# EAGLE design pwmCatMoto (EAGLE 8.6.0)
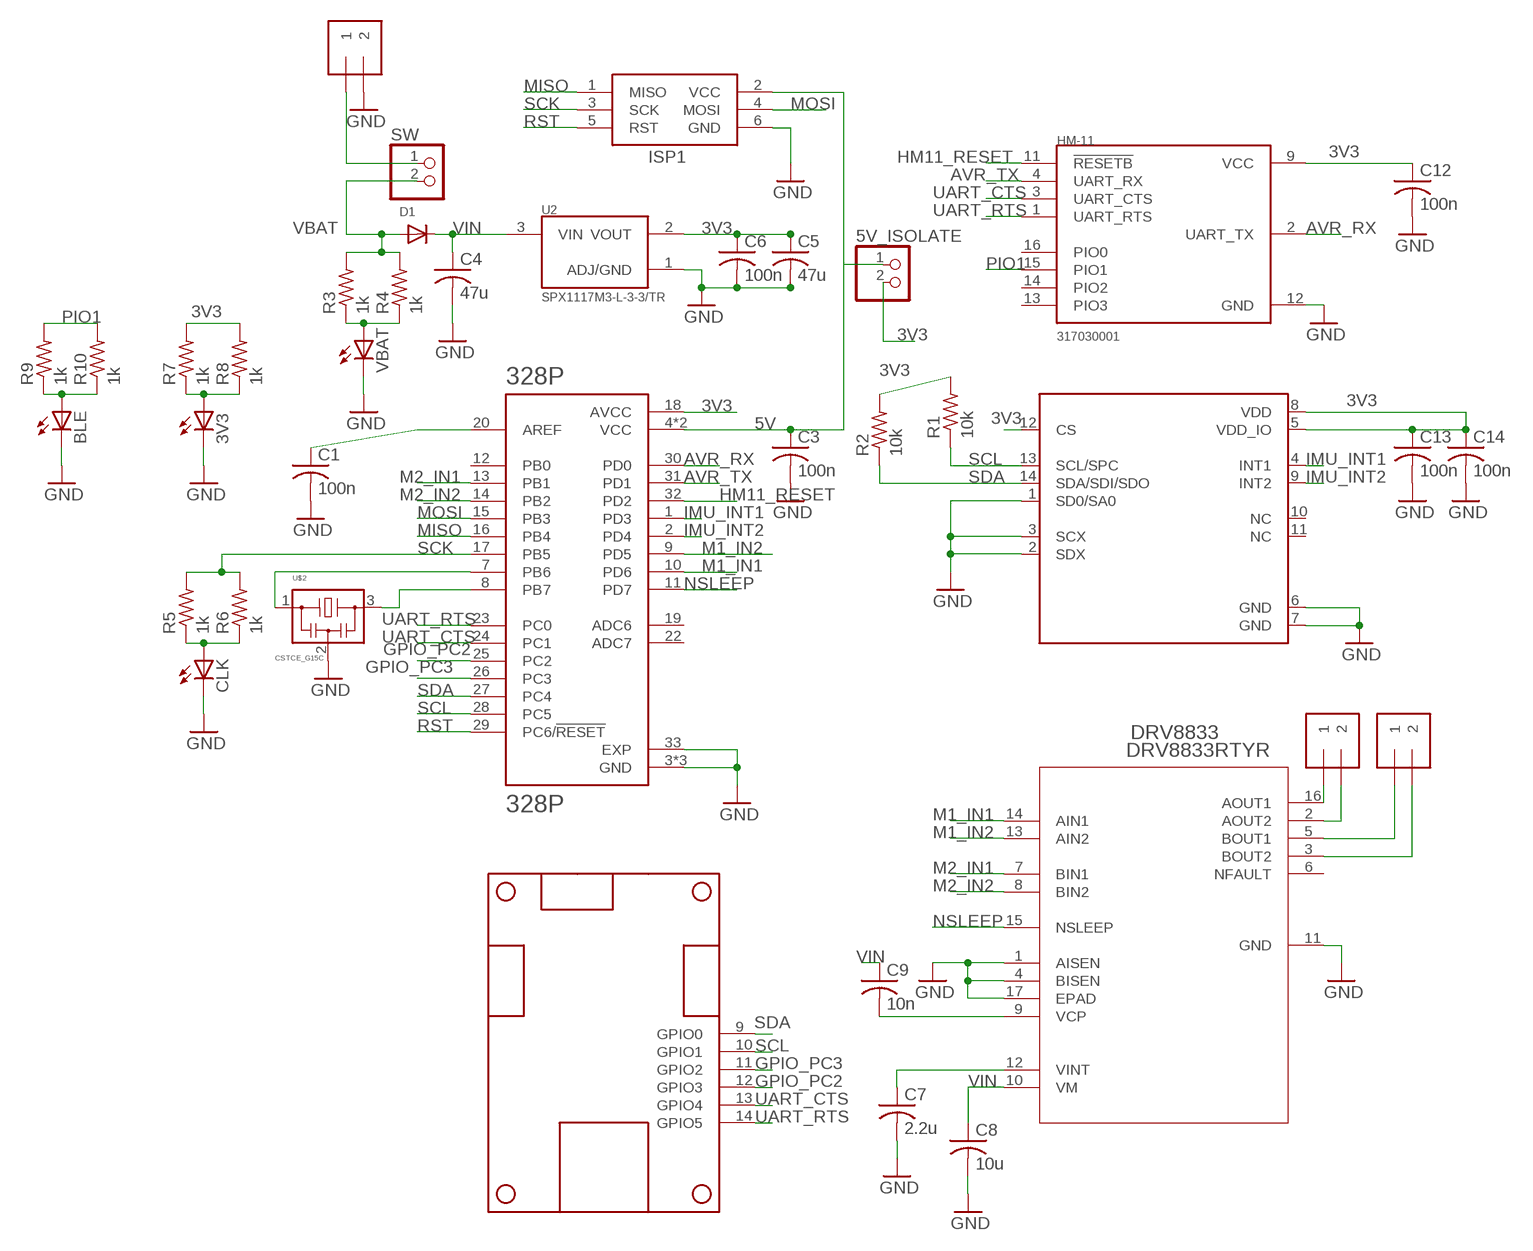
[diagram p0: schematic, sheet 1]

## Parts
3V3  LEDCHIPLED_0805  [CHIPLED_0805]
5V_ISOLATE  JUMPER  [1X02]
328P  328P  ATMEGA328P-MU  [QFN50P500X500X100-33N]
ACCEL  LSM6DS3TR  [14VFLGA_LSM6DS3TR]
BLE  LEDCHIPLED_0805  [CHIPLED_0805]
C1  100n  C-USC0402K  [C0402K]
C3  100n  C-USC0402K  [C0402K]
C4  47u  C-USC0805K  [C0805K]
C5  47u  C-USC0805K  [C0805K]
C6  100n  C-USC0402K  [C0402K]
C7  2.2u  C-USC0402K  [C0402K]
C8  10u  C-USC0402K  [C0402K]
C9  10n  C-USC0402K  [C0402K]
C12  100n  C-USC0402K  [C0402K]
C13  100n  C-USC0402K  [C0402K]
C14  100n  C-USC0402K  [C0402K]
CLK  LEDCHIPLED_0805  [CHIPLED_0805]
D1  DIODESOD-123  [SOD-123]
DRV8833  DRV8833RTYR  [RTY16]
HM-11  317030001  [XCVR_317030001]
ISP1  AVRISP-6  [AVRISP]
J4  1X2-3.5MM  [1X2-3.5MM]
J5  1X2-3.5MM  [1X2-3.5MM]
J6  1X2-3.5MM  [1X2-3.5MM]
R1  10k  R-US_R0402  [R0402]
R2  10k  R-US_R0402  [R0402]
R3  1k  R-US_R0402  [R0402]
R4  1k  R-US_R0402  [R0402]
R5  1k  R-US_R0402  [R0402]
R6  1k  R-US_R0402  [R0402]
R7  1k  R-US_R0402  [R0402]
R8  1k  R-US_R0402  [R0402]
R9  1k  R-US_R0402  [R0402]
R10  1k  R-US_R0402  [R0402]
SW  KILLSWITCH  [1X02]
U2  SPX1117M3-L-3-3/TR  [SOT230P700X180-3N]
U$1  TANK_BOARD_OUTLINE_GPIO  [TANK_BOARD_1]
U$2  CSTCE_G15C  [CSTCE_G15C]
VBAT  LEDCHIPLED_0805  [CHIPLED_0805]

## Nets
3V3: 5V_ISOLATE.2 328P.18(AVCC) ACCEL.5(VDD_IO) ACCEL.8(VDD) ACCEL.12(CS) C5.1 C6.1 C12.1 C13.1 C14.1 HM-11.9(VCC) R1.2 R2.2 R7.2 R8.2 U2.2(VOUT)
5V: 5V_ISOLATE.1 328P.4(VCC) 328P.6(VCC) C3.1 ISP1.2(VCC)
AVR_RX: 328P.30(PD0) HM-11.2(UART_TX)
AVR_TX: 328P.31(PD1) HM-11.4(UART_RX)
GND: 3V3.C 328P.3(GND) 328P.5(GND) 328P.21(GND) 328P.33(EXP) ACCEL.1(SD0/SA0) ACCEL.2(SDX) ACCEL.3(SCX) ACCEL.6(GND) ACCEL.7(GND) BLE.C C1.2 C3.2 C4.2 C5.2 C6.2 C7.2 C8.2 C12.2 C13.2 C14.2 CLK.C DRV8833.1(AISEN) DRV8833.4(BISEN) DRV8833.11(GND) DRV8833.17(EPAD) HM-11.12(GND) ISP1.6(GND) J4.2 U2.1(ADJ/GND) U$2.2 VBAT.C
GPIO_PC2: 328P.25(PC2) U$1.12(GPIO3)
GPIO_PC3: 328P.26(PC3) U$1.11(GPIO2)
HM11_RESET: 328P.32(PD2) HM-11.11(!RESETB)
IMU_INT1: 328P.1(PD3) ACCEL.4(INT1)
IMU_INT2: 328P.2(PD4) ACCEL.9(INT2)
M1_IN1: 328P.10(PD6) DRV8833.14(AIN1)
M1_IN2: 328P.9(PD5) DRV8833.13(AIN2)
M2_IN1: 328P.13(PB1) DRV8833.7(BIN1)
M2_IN2: 328P.14(PB2) DRV8833.8(BIN2)
MISO: 328P.16(PB4) ISP1.1(MISO)
MOSI: 328P.15(PB3) ISP1.4(MOSI)
N$1: C7.1 DRV8833.12(VINT)
N$2: 328P.7(PB6) U$2.1
N$3: 328P.8(PB7) U$2.3
N$4: 328P.20(AREF) C1.1
N$5: C9.2 DRV8833.9(VCP)
N$6: J4.1 SW.1
N$7: R3.1 R4.1 VBAT.A
N$9: BLE.A R9.1 R10.1
N$11: CLK.A R5.1 R6.1
N$13: 3V3.A R7.1 R8.1
N$17: DRV8833.16(AOUT1) J5.1
N$18: DRV8833.2(AOUT2) J5.2
N$19: DRV8833.5(BOUT1) J6.1
N$20: DRV8833.3(BOUT2) J6.2
NSLEEP: 328P.11(PD7) DRV8833.15(NSLEEP)
PIO1: HM-11.15(PIO1) R9.2 R10.2
RST: 328P.29(PC6/!RESET) ISP1.5(RST)
SCK: 328P.17(PB5) ISP1.3(SCK) R5.2 R6.2
SCL: 328P.28(PC5) ACCEL.13(SCL/SPC) R1.1 U$1.10(GPIO1)
SDA: 328P.27(PC4) ACCEL.14(SDA/SDI/SDO) R2.1 U$1.9(GPIO0)
UART_CTS: 328P.24(PC1) HM-11.3(UART_CTS) U$1.13(GPIO4)
UART_RTS: 328P.23(PC0) HM-11.1(UART_RTS) U$1.14(GPIO5)
VBAT: D1.A R3.2 R4.2 SW.2
VIN: C4.1 C8.1 C9.1 D1.C DRV8833.10(VM) U2.3(VIN)
Unconnected: 328P.12(PB0) 328P.19(ADC6) 328P.22(ADC7) DRV8833.6(NFAULT) HM-11.13(PIO3) HM-11.14(PIO2) HM-11.16(PIO0)

## Power pins joined to a net without a drawn wire
NC: ACCEL.10(NC) ACCEL.11(NC)

## Library data of the parts
3V3 BLE CLK VBAT = adafruit:LED: LED OSRAM: - CHIPLED LG R971, LG N971, LY N971, LG Q971, LY Q971, LO R971, LY R971 LH N974, LH R974 LS Q976, LO Q976, LY Q976 LO Q996 - Hyper CHIPLED LW Q18S LB Q993, LB Q99A, LB R99A - SideLED LS A670, LO A670, LY A670, LG A670, LP A670 LB A673, LV A673, LT A673, LW A673 LH A674 LY A675 LS A676, LA A676, LO A676, LY A676, LW A676 LS A679, LY A679, LG A679 - Hyper Micro SIDELED® LS Y876, LA Y876, LO Y876, LY Y876 LT Y87S - SmartLED LW L88C, LW L88S LB L89C, LB L89S, LG L890 LS L89K, LO L89K, LY L89K LS L896, LA L896, LO L896, LY L896 - TOPLED LS T670, LO T670, LY T670, LG T670, LP T670 LSG T670, LSP T670, LSY T670, LOP T670, LYG T670 LG T671, LOG T671, LSG T671 LB T673, LV T673, LT T673, LW T673 LH T674 LS T676, LA T676, LO T676, LY T676, LB T676, LH T676, LSB T676, LW T676 LB T67C, LV T67C, LT T67C, LS T67K, LO T67K, LY T67K, LW E67C LS E67B, LA E67B, LO E67B, LY E67B, LB E67C, LV E67C, LT E67C LW T67C LS T679, LY T679, LG T679 LS T770, LO T770, LY T770, LG T770, LP T770 LB T773, LV T773, LT T773, LW T773 LH T774 LS E675, LA E675, LY E675, LS T675 LS T776, LA T776, LO T776, LY T776, LB T776 LHGB T686 LT T68C, LB T68C - Hyper Mini TOPLED® LB M676 - Mini TOPLED Santana® LG M470 LS M47K, LO M47K, LY M47K Source: http://www.osram.convergy.de/
5V_ISOLATE = EE310_rcTank_ProtoA:JUMPER
328P = EE310_rcTank_ProtoA:ATMEGA328P-MU: ATmega Series 20 MHz 32 KB Flash 2 KB SRAM 8-Bit Microcontroller - QFN-32; AVAILABILITY: Good; DESCRIPTION: IC MCU 8BIT 32KB FLASH 32VQFN; MF: Microchip; MP: ATMEGA328P-MU; PACKAGE: VQFN-32 Microchip; PRICE: 2.07 USD
ACCEL = EE310_rcTank_ProtoA:LSM6DS3TR
C1 C3-C9 C12-C14 = rcl:C-US: CAPACITOR, American symbol; SPICEPREFIX: C
D1 = adafruit:DIODE: Diode SMADIODE - SMA Surface Mount Package 20V 1A Schottky Diode Digikey: 641-1014-6-ND DO-1N4148 - Through Hole Small Current Diode SOD-123 20V 1 A (.5mV Vf) Schottky Diode - Digikey: MBRX120TPMSCT-ND SOD-323 10V 570mA (.38mV Vf, 3ns) Schottky Diode - Digikey: ZLLS410CT-ND SOD-523 30V 30mA Schottky Diode (RB751S-40TE61) - Digikey: RB751S-40TE61CT-ND SOT23-R/W - SOT23 Package (R = Solder Paste/Reflow Ovens, W = Hand-Soldering) BAT54Film 40V 300mA - Digikey: 497-7162-1-ND
DRV8833 = EE310_rcTank_ProtoA:DRV8833RTYR; MANUFACTURER_PART_NUMBER: DRV8833RTYR; VENDOR: Texas Instruments
HM-11 = EE310_rcTank_ProtoA:317030001: Bluetooth V4.0 Hm-11 Ble Module; AVAILABILITY: Bad; DESCRIPTION: BLUETOOTH V4.0 HM-11 BLE MODULE; MF: Seeed Studio; MP: 317030001; PACKAGE: Module Seeed Studio; PRICE: 12.89 USD
ISP1 = adafruit:AVRISP: AVR ISP HEADER Standard 6 pin header for AVR programming
J4-J6 = adafruit:1X2: 3.5mm Terminal block http://www.ladyada.net/library/pcb/eaglelibrary.html
R1-R10 = rcl:R-US_: RESISTOR, American symbol; SPICEPREFIX: R
SW = EE310_rcTank_ProtoA:KILLSWITCH
U2 = EE310_rcTank_ProtoA:SPX1117M3-L-3-3/TR; AVAILABILITY: Good; DESCRIPTION: IC REG LINEAR 3.3V 800MA SOT223; MF: Exar Corporation; MP: SPX1117M3-L-3-3/TR; PACKAGE: SOT-223 Exar; PRICE: 0.19 USD
U$1 = EE310_rcTank_ProtoA:TANK_BOARD_OUTLINE_GPIO
U$2 = EE310_rcTank_ProtoA:CSTCE_G15C

## Board
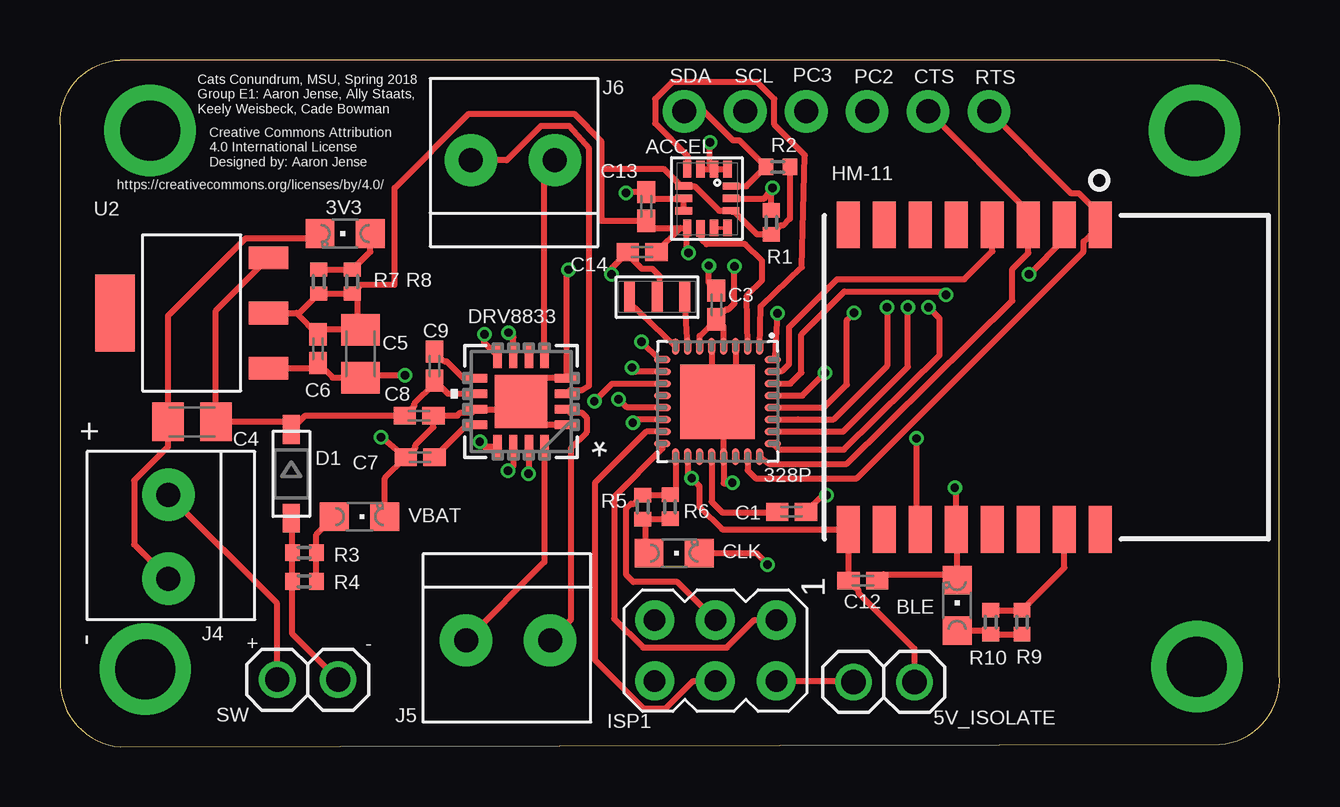
[diagram p1: board, top side]
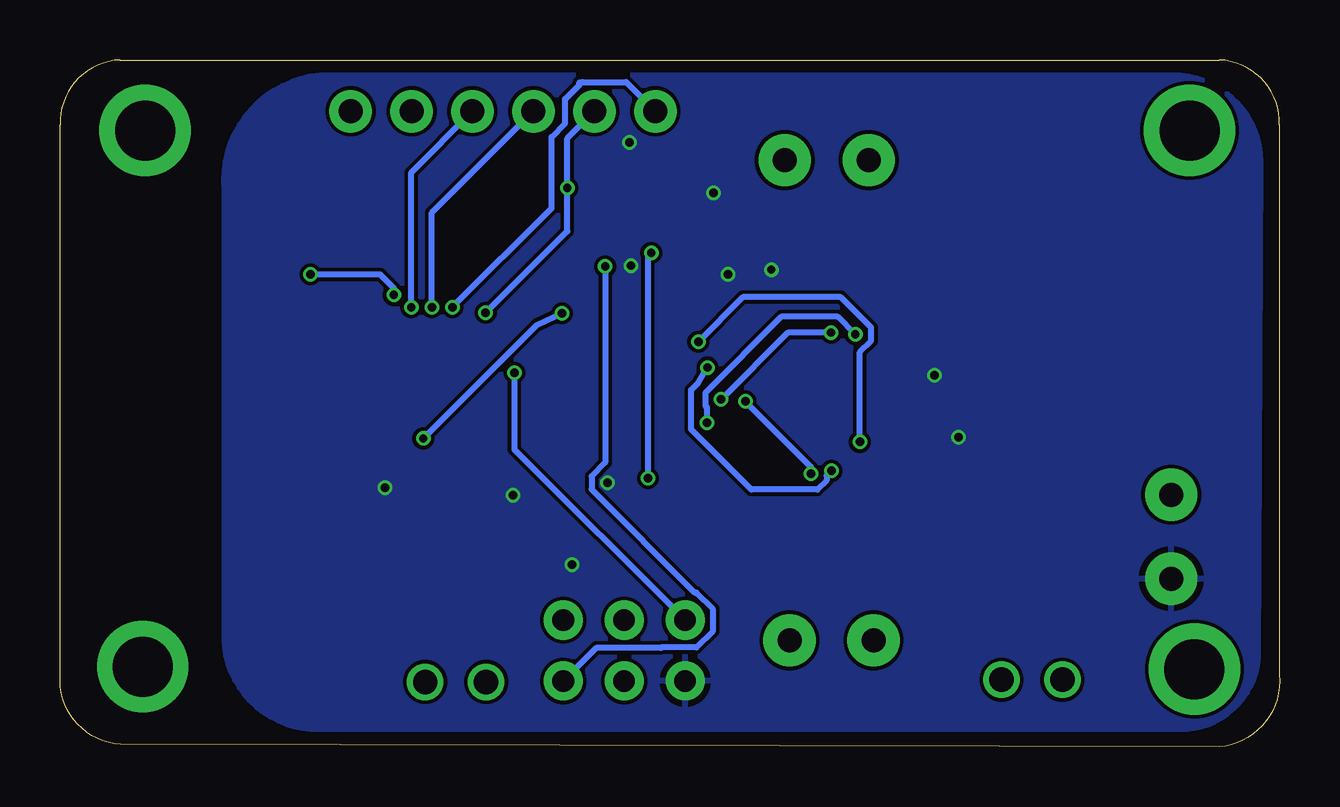
[diagram p2: board, bottom side, seen from below]

Size 50.82 x 28.64 mm. Coordinates in mm from the lower left corner, seen from the top.
Copper layers (1*16): Top 0.035559375mm / dielectric 1.6mm / Bottom 0.035559375mm
Design rules "oshpark-2layer": minimum track width 6mil, minimum drill 10mil, track to track 6mil, track to pad 6mil, pad to pad 6mil, via to via 6mil, smd to smd 6mil, copper to edge 15mil, drill to drill 6mil, minimum pad ring 5mil, minimum via ring 5mil, stop-mask expansion 2.5mil, vias tented up to drill 0mil, thermal gap 10mil

### Footprints (pad centres in the part's own frame; a part is rotated, then mirrored left to right if it is on the bottom)
CHIPLED_0805 = smd 1.2 x 1.2: A 0,-1.05; C 0,1.05
1X02 = drill 1.016: 1 1.27,0; 2 3.81,0
QFN50P500X500X100-33N = smd 0.69 x 0.29: 1 -2.3,1.75; 8 -2.3,-1.75; 17 2.3,-1.75; 24 2.3,1.75 | smd 0.7 x 0.29: 2 -2.3,1.25; 3 -2.3,0.75; 4 -2.3,0.25; 5 -2.3,-0.25; 6 -2.3,-0.75; 7 -2.3,-1.25; 18 2.3,-1.25; 19 2.3,-0.75; 20 2.3,-0.25; 21 2.3,0.25; 22 2.3,0.75; 23 2.3,1.25 | smd 0.29 x 0.69: 9 -1.75,-2.3; 16 1.75,-2.3; 25 1.75,2.3; 32 -1.75,2.3 | smd 0.29 x 0.7: 10 -1.25,-2.3; 11 -0.75,-2.3; 12 -0.25,-2.3; 13 0.25,-2.3; 14 0.75,-2.3; 15 1.25,-2.3; 26 1.25,2.3; 27 0.75,2.3; 28 0.25,2.3; 29 -0.25,2.3; 30 -0.75,2.3; 31 -1.25,2.3 | smd 3.1 x 3.1: 33 0,0
14VFLGA_LSM6DS3TR = smd 0.69 x 0.34: 1 -1.22,0.84; 2 -1.22,0.28; 3 -1.22,-0.28; 4 -1.22,-0.84; 8 1.23,-0.84; 9 1.24,-0.28; 10 1.23,0.28; 11 1.23,0.84 | smd 0.3 x 0.69: 5 -0.52,-0.98; 6 0,-0.98; 7 0.52,-0.98; 12 0.51,0.99; 13 0,0.99; 14 -0.51,0.99
C0402K = smd 0.925 x 0.74: 1 -0.6,0; 2 0.6,0
C0805K = smd 1.3 x 1.6: 1 -1,0; 2 1,0
SOD-123 = smd 1.2 x 0.7: A 1.85,0; C -1.85,0
RTY16 = smd 1 x 0.35: 1 -1.9,0.975; 2 -1.9,0.325; 3 -1.9,-0.325; 4 -1.9,-0.975; 9 1.9,-0.975; 10 1.9,-0.325; 11 1.9,0.325; 12 1.9,0.975 | smd 0.35 x 1: 5 -0.975,-1.9; 6 -0.325,-1.9; 7 0.325,-1.9; 8 0.975,-1.9; 13 0.975,1.9; 14 0.325,1.9; 15 -0.325,1.9; 16 -0.975,1.9 | smd 2.2 x 2.2: 17 0,0
XCVR_317030001 = smd 1.95 x 0.95: 1 -6.35,2.25; 2 -6.35,0.75; 3 -6.35,-0.75; 4 -6.35,-2.25; 5 -6.35,-3.75; 6 -6.35,-5.25; 7 -6.35,-6.75; 8 -6.35,-8.25; 9 6.35,-8.25; 10 6.35,-6.75; 11 6.35,-5.25; 12 6.35,-3.75; 13 6.35,-2.25; 14 6.35,-0.75; 15 6.35,0.75; 16 6.35,2.25
AVRISP = drill 0.9 pad 1.626: 1 -1.27,2.54; 2 1.27,2.54; 3 -1.27,0; 4 1.27,0; 5 -1.27,-2.54; 6 1.27,-2.54
1X2-3.5MM = drill 1 pad 2.184: 1 1.8,0; 2 -1.7,0
R0402 = smd 0.6 x 0.7: 1 -0.5,0; 2 0.5,0
SOT230P700X180-3N = smd 1.65 x 0.95: 1 -3.2,2.3; 2 -3.2,0; 3 -3.2,-2.3 | smd 1.65 x 3.2: 4 3.2,0
TANK_BOARD_1 = drill 1 pad 1.778: 9 24.73,26; 10 27.27,26; 11 29.81,26; 12 32.35,26; 13 34.89,26; 14 37.43,26 | drill 2.5 pad 3.81: P$5 2.47,25.2; P$6 2.27,2.74; P$7 45.99,25.2; P$8 46.09,2.84
CSTCE_G15C = smd 0.45 x 1.3: 1 0.45,-0.65; 2 1.6,-0.65; 3 2.75,-0.65

### Placement (x,y rotation side)
3V3  11.88,21.4 90 top
5V_ISOLATE  31.79,2.71 0 top
328P  27.4,14.4 270 top
ACCEL  26.97,22.87 270 top
BLE  37.38,5.9 0 top
C1  30.48,9.8 0 top
C3  27.35,18.43 90 top
C4  5.5,13.55 180 top
C5  12.52,16.39 270 top
C6  10.75,16.6 270 top
C7  15,12.08 180 top
C8  14.96,13.81 0 top
C9  15.61,15.88 90 top
C12  33.45,6.94 0 top
C13  24.43,22.53 90 top
C14  24.25,20.63 180 top
CLK  25.59,8.08 270 top
D1  9.64,11.38 270 top
DRV8833  19.21,14.4 180 top
HM-11  41.1,15.42 270 top
ISP1  27.31,4.02 270 top
J4  4.52,8.71 90 top
J5  18.72,4.44 180 top
J6  18.82,24.46 0 top
R1  29.64,21.87 270 top
R2  29.91,24.18 0 top
R3  10.18,8.1 180 top
R4  10.18,6.9 180 top
R5  24.28,10 90 top
R6  25.42,10.01 90 top
R7  10.78,19.4 270 top
R8  12.18,19.4 270 top
R9  40.08,5.2 90 top
R10  38.78,5.2 90 top
SW  7.78,2.8 0 top
U2  5.49,18.09 180 top
U$1  1.28,0.5 0 top
U$2  26.48,18.1 180 top
VBAT  12.48,9.6 270 top

### Tracks (layer width: path | path; a pad name or v marks a point on that pad's centre or on a via)
3V3  (via drill 0.35)
  Top 0.254: 25.86,21.64 24.72,21.64 C13.1 22.55,21.93 22.55,24.1 | 29.52,21.37 R1.2 | R1.2 29.04,21.37 28.1,22.31 28,22.31 ACCEL.12 27.46,22.36 26.44,23.38 26,23.38 ACCEL.5 25.96,23.41 25.84,23.41 25.16,24.1 22.55,24.1 | R1.2 30.01,21.74 30.13,21.74 30.41,22.02 R2.2 | C5.1 12.38,17.39 | 12.38,17.39 10.94,17.39 C6.1 9.86,18.09 U2.2 9.97,18.09 R7.2 R8.2 | R8.2 12.38,18.7 12.38,17.39 | R8.2 12.55,19.27 13.95,19.27 13.95,23.3 17.04,26.39 21.42,26.39 22.55,25.26 22.55,24.1 | 25.86,21.64 C14.1 24.88,20.6 | 25.86,21.64 ACCEL.8 | ACCEL.8 | 5V_ISOLATE.2 35.6,4.09 33.26,6.43 33.26,6.53 C12.1 HM-11.9 27.59,9.07 26.64,10.01 26.64,10.88 v26.32,11.2 26.16,11.36 328P.18 | v26.18,20.6 26.12,20.66 ACCEL.8
  Bottom 0.254: v26.18,20.6 26.32,20.46 v26.32,11.2
5V  (via drill 0.35)
  Top 0.254: 328P.4 27.65,17.53 C3.1 | 328P.6 26.65,17.13 C3.1 | C3.1 27.75,18.24 27.85,18.24 28.1,18.48 v28.1,20.03 | 5V_ISOLATE.1 33.03,2.75 ISP1.2
  Bottom 0.254: v28.1,20.03 28.1,11.85 28.67,11.28 28.67,10.74 24.36,6.43 24.3,6.43 23.63,5.76 23.63,4.81 24.3,4.14 25.76,4.14 25.78,4.12 28.48,4.12 ISP1.2
AVR_RX  (via drill 0.35)
  Top 0.254: v40.38,19.7 41.85,21.17 HM-11.2 | 328P.30 30.43,15.15 30.89,15.61 30.89,17.2 32.68,18.99 36.76,18.99 v36.91,18.84
  Bottom 0.254: v40.38,19.7 37.48,19.7 36.91,19.13 v36.91,18.84
AVR_TX
  Top 0.254: HM-11.4 38.85,20.67 37.68,19.5 32.38,19.5 30.38,17.5 30.38,15.96 30.1,15.67 29.73,15.67 328P.31
GND  (via drill 0.35)
  Top 0.254: DRV8833.1 20.16,13.42 19.21,14.37 DRV8833.17 18.89,14.07 DRV8833.11 17.17,13.93 16.68,13.93 16.55,13.81 C8.2 15.56,13.33 14.81,12.58 14.81,12.48 C7.2 | ACCEL.7 ACCEL.6 24.69,22.87 C13.2 23.61,23.13 v23.58,23.1 | BLE.C 37.38,7.2 | 37.38,7.2 37.38,9.04 HM-11.12 37.35,10.73 v37.28,10.8 | C12.2 34.32,7.2 37.38,7.2 | U2.1 10.54,15.79 C6.2 11.36,15.39 C5.2 12.63,15.5 v14.38,15.5 | J4.2 3.09,8.44 3.09,11.1 4.5,12.51 C4.2 4.5,17.97 7.72,21.19 10.62,21.19 3V3.C | VBAT.C 13.53,11.21 C7.2 | 328P.5 27.15,14.65 328P.33 | 328P.3 28.15,15.15 328P.33 | DRV8833.4 | DRV8833.4 21.11,19.83 v21.18,19.9 | ACCEL.3 ACCEL.2 | ACCEL.2 ACCEL.1 | ACCEL.2 27.08,24.26 v27.08,25.2 | U$2.2 24.99,19.45 24.99,19.64 24.7,19.93 24.25,19.93 23.71,20.47 23.65,20.47 C14.2 22.98,19.96 v22.98,19.7 | CLK.C 26.88,7.65 | 29.4,7.68 v29.48,7.6 29,8.08 CLK.C | 27.71,13.22 27.67,13.19 | 27.67,13.19 27.68,13.19 27.68,14.12 328P.33 | CLK.C 27.07,7.65 | v28.01,11.01 27.87,10.99 27.65,10.99 328P.21 27.65,13.19 27.67,13.19 | DRV8833.4 | DRV8833.4 20.19,15.38 | C7.2 v13.38,12.91 | C1.2 31.77,10.49 v31.94,10.49 | C3.2 27.03,19.35 v27.03,20.07
  pour Bottom: 0.78,24.4 arc-90 4.48,27.99 39.98,27.99 arc-90 43.98,23.2 43.98,4.5 arc-90 39.98,0.75 4.48,0.75 arc-90 0.88,3.7
GPIO_PC2  (via drill 0.35)
  Top 0.254: 328P.25 29.95,12.4 32.67,12.4 36.65,16.33 36.65,17.86 v36.18,18.33
  Bottom 0.254: v36.18,18.33 36.18,23.95 U$1.12
GPIO_PC3  (via drill 0.35)
  Top 0.254: 29.73,13.17 328P.26 32.63,13.15 35.32,15.84 v35.32,18.33
  Bottom 0.254: v35.32,18.33 35.32,22.27 U$1.11
HM11_RESET  (via drill 0.35)
  Top 0.254: 328P.32 29.8,16.25 v29.9,18.08 | v35.68,12.86 35.68,9.24 HM-11.11
  Bottom 0.254: v29.9,18.08 30.96,17.58 v35.68,12.86
IMU_INT1
  Top 0.254: ACCEL.4 26.15,24.64 24.79,25.99 24.79,27 25.51,27.72 29.06,27.72 29.77,27 29.77,25.94 31.04,24.67 30.91,20 29.19,18.36 328P.1
IMU_INT2
  Top 0.254: ACCEL.9 26.75,21.58 26.75,21.16 26.94,20.96 28.56,20.96 29.25,20.27 29.25,19.45 28.62,18.82 328P.2
M1_IN1  (via drill 0.35)
  Top 0.254: DRV8833.14 18.89,11.72 v18.67,11.51 | 328P.10 24.01,15.65 v23.84,15.82
  Bottom 0.254: v18.67,11.51 18.87,11.31 18.87,11.12 19.26,10.73 22.01,10.73 24.52,13.24 24.52,14.89 24.23,15.18 v23.84,15.82
M1_IN2  (via drill 0.35)
  Top 0.254: DRV8833.13 17.71,12.5 v17.49,12.72 | v24.22,16.89 24.96,16.15 328P.9
  Bottom 0.254: v17.49,12.72 17.49,16.46 17.02,16.93 17.02,17.49 18.28,18.75 22.36,18.75 v24.22,16.89
M2_IN1  (via drill 0.35)
  Top 0.254: 328P.13 25.08,14.17 23.59,14.17 v23.27,14.49 | DRV8833.7 18.89,17.07 v18.69,17.27
  Bottom 0.254: v18.69,17.27 20.49,17.27 v23.27,14.49
M2_IN2  (via drill 0.35)
  Top 0.254: DRV8833.8 17.68,16.85 v17.68,17.2 | 328P.14 24,13.65 v23.87,13.52
  Bottom 0.254: 17.85,17.2 v17.68,17.2 18.41,17.93 20.76,17.93 23.93,14.76 23.93,14.22 23.87,14.15 v23.87,13.52
MISO
  Top 0.254: 328P.16 25.1,12.44 23.09,10.43 23.09,5.35 24.3,4.14 27.78,4.14 28.93,5.29 ISP1.1
MOSI
  Top 0.254: 328P.15 24.43,13.15 22.28,11 22.28,3.62 24.3,1.6 25.24,1.6 26.39,2.75 ISP1.4
N$1
  Top 0.254: C7.1 16.95,13.42 DRV8833.12
N$2
  Top 0.254: 328P.7 26.05,18.37 U$2.1
N$3
  Top 0.254: 25.61,16.89 25.61,16.74 328P.8 23.71,18.54 U$2.3
N$4
  Top 0.254: 27.18,12.07 328P.20 | 328P.20 | 328P.20 27.15,10.22 27.6,9.77 29.85,9.77 C1.1
N$5
  Top 0.254: C9.2 16.01,16.07 16.11,16.07 16.81,15.38 DRV8833.9
N$6
  Top 0.254: SW.1 9.05,5.98 J4.1
N$7
  Top 0.254: R4.1 R3.1 10.68,8.85 VBAT.A
N$9
  Top 0.254: BLE.A 38.63,4.85 R10.1 R9.1
N$11
  Top 0.254: 24.38,9.5 R5.1 | CLK.A 24.38,8.05 24.38,9.4 R5.1 | R6.1 R5.1
N$13
  Top 0.254: R7.1 R8.1 12.93,20.65 3V3.A
N$17
  Top 0.254: DRV8833.16 20.19,7.71 J5.1
N$18
  Top 0.254: DRV8833.2 21.25,13.93 21.75,13.93 21.94,13.74 21.94,13.11 21.28,12.45 21.28,5.3 J5.2
N$19
  Top 0.254: DRV8833.5 20.19,24.03 J6.1
N$20
  Top 0.254: DRV8833.3 21.26,14.87 21.75,14.87 22.04,15.06 22.04,24.95 21.21,25.88 20.03,25.88 18.61,24.46 J6.2
NC
  Top 0.152: ACCEL.10 ACCEL.11
NSLEEP  (via drill 0.35)
  Top 0.254: DRV8833.15 v19.54,11.4 v19.53,11.39 | v22.26,14.41 23,15.15 328P.11
  Bottom 0.254: v19.53,11.39 19.53,11.68 v22.26,14.41
PIO1
  Top 0.254: R10.2 R9.2 41.85,7.47 HM-11.15
RST  (via drill 0.35)
  Top 0.254: 328P.29 30.23,14.65 30.93,14.65 v31.88,15.6
  Bottom 0.254: v31.88,15.6 31.88,12.4 ISP1.5
SCK
  Top 0.254: ISP1.3 25.73,6.87 23.89,6.87 23.6,7.16 23.6,9.94 23.79,10.13 23.91,10.13 R5.2 R6.2 25.65,10.74 328P.17 25.65,11.87
SCL  (via drill 0.35)
  Top 0.254: ACCEL.13 29.35,22.87 v29.68,23.3 29.64,23.26 R1.1 | 328P.28 31.83,14.15 32.78,15.1 32.78,17.8 v33.08,18.1
  Bottom 0.254: U$1.10 29.68,25.37 v29.68,23.3 29.68,21.5 v33.08,18.1
SDA  (via drill 0.35)
  Top 0.254: U$1.9 26.83,26.5 28.05,25.28 28.31,25.28 R2.1 28.6,23.38 ACCEL.14 | v34.47,18.33 34.47,15.88 32.24,13.66 30.76,13.66 30.75,13.65 328P.27
  Bottom 0.254: v34.47,18.33 30.34,22.46 30.34,25.43 29.77,26 29.77,27 29.18,27.59 29.18,27.7 29.08,27.7 29.06,27.72 27.23,27.72 U$1.9
UART_CTS
  Top 0.254: U$1.13 40.35,22.32 HM-11.3 40.35,20.6 39.68,19.93 39.68,18.6 32.78,11.8 29.55,11.8 328P.24
UART_RTS
  Top 0.254: 328P.23 28.65,11.53 28.98,11.2 33.2,11.2 42.65,20.66 42.65,21.07 HM-11.1 43.35,22.18 42.46,23.07 42.14,23.07 U$1.14
VBAT
  Top 0.254: SW.2 9.68,4.71 R4.2 R3.2 9.68,9.49 D1.A
VIN
  Top 0.254: DRV8833.10 16.16,14.72 C9.1 15.61,15.15 14.77,14.31 14.77,14.21 C8.1 10.22,13.81 D1.C 9.32,13.55 C4.1 6.5,18.2 U2.3

### Text on the board
_tsilk: SDA | SCL | PC3 | PC2 | CTS | RTS | Cats Conundrum, MSU, Spring 2018 / Group E1: Aaron Jense, Ally Staats, / Keely Weisbeck, Cade Bowman | Creative Commons Attribution / 4.0 International License / Designed by: Aaron Jense | https://creativecommons.org/licenses/by/4.0/ | + | - | + | -